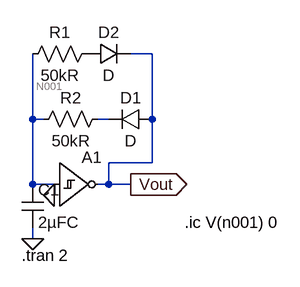
[diagram p0: schematic osc.asc]
osc.asc, the LTspice schematic file:
Version 4
SHEET 1 880 680
WIRE 224 -96 192 -96
WIRE 48 0 48 -96
WIRE 64 0 48 0
WIRE 160 0 144 0
WIRE 224 0 224 -96
WIRE 224 64 224 0
WIRE 224 64 160 64
WIRE 48 96 48 0
WIRE 80 96 48 96
WIRE 160 96 160 64
WIRE 160 96 144 96
WIRE 192 96 160 96
WIRE 48 176 48 160
FLAG 48 176 0
FLAG 192 96 Vout
IOPIN 192 96 Out
FLAG 80 112 0
SYMBOL Digital\\schmtinv 80 32 R0
WINDOW 3 0 0 Invisible 0
SYMATTR Value Vhigh=9 Vt=4.45 Vh=.85 Trise=.1u Tfall=.1u
SYMATTR InstName A1
SYMBOL diode 224 -16 R90
WINDOW 0 0 32 VBottom 2
WINDOW 3 32 32 VTop 2
SYMATTR InstName D1
SYMBOL cap 32 96 R0
SYMATTR InstName C1
SYMATTR Value 2µFC
SYMBOL diode 128 -80 R270
WINDOW 0 32 32 VTop 2
WINDOW 3 0 32 VBottom 2
SYMATTR InstName D2
SYMBOL res 144 -112 R90
WINDOW 0 0 56 VBottom 2
WINDOW 3 32 56 VTop 2
SYMATTR InstName R1
SYMATTR Value 50kR
SYMBOL res 160 -16 R90
WINDOW 0 0 56 VBottom 2
WINDOW 3 32 56 VTop 2
SYMATTR InstName R2
SYMATTR Value 50kR
TEXT 272 152 Left 2 !.ic V(n001) 0
TEXT 32 200 Left 2 !.tran 2

The netlist it stands for:
* osc.asc
A1 N001 0 0 0 0 Vout 0 0 SCHMITT Vhigh=9 Vt=4.45 Vh=.85 Trise=.1u Tfall=.1u
D1 Vout N002 D
C1 N001 0 2µFC
D2 P001 Vout D
R1 P001 N001 50kR
R2 N002 N001 50kR
.model D D
.lib standard.dio
.ic V(n001) 0
.tran 2
.backanno
.end